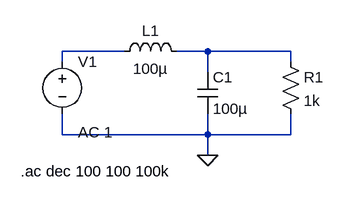
[diagram p0: schematic LC network Poles and Zeros.asc]
LC network Poles and Zeros.asc, the LTspice schematic file:
Version 4
SHEET 1 880 680
WIRE 48 96 -48 96
WIRE 176 96 128 96
WIRE 304 96 176 96
WIRE -48 112 -48 96
WIRE 304 112 304 96
WIRE 176 128 176 96
WIRE -48 224 -48 192
WIRE 176 224 176 192
WIRE 176 224 -48 224
WIRE 304 224 304 192
WIRE 304 224 176 224
WIRE 176 256 176 224
FLAG 176 256 0
SYMBOL voltage -48 96 R0
WINDOW 123 24 124 Left 2
WINDOW 39 0 0 Left 2
SYMATTR InstName V1
SYMATTR Value ""
SYMATTR Value2 AC 1
SYMBOL ind 32 112 R270
WINDOW 0 32 56 VTop 2
WINDOW 3 5 56 VBottom 2
SYMATTR InstName L1
SYMATTR Value 100µ
SYMBOL cap 160 128 R0
SYMATTR InstName C1
SYMATTR Value 100µ
SYMBOL res 288 96 R0
SYMATTR InstName R1
SYMATTR Value 1k
TEXT -112 280 Left 2 !.ac dec 100 100 100k

The netlist it stands for:
* LC network Poles and Zeros.asc
V1 N001 0 AC 1
L1 N001 N002 100µ
C1 N002 0 100µ
R1 N002 0 1k
.ac dec 100 100 100k
.backanno
.end